# EAGLE schematic RF1 (EAGLE 6.4)
www.komby.com/RF1
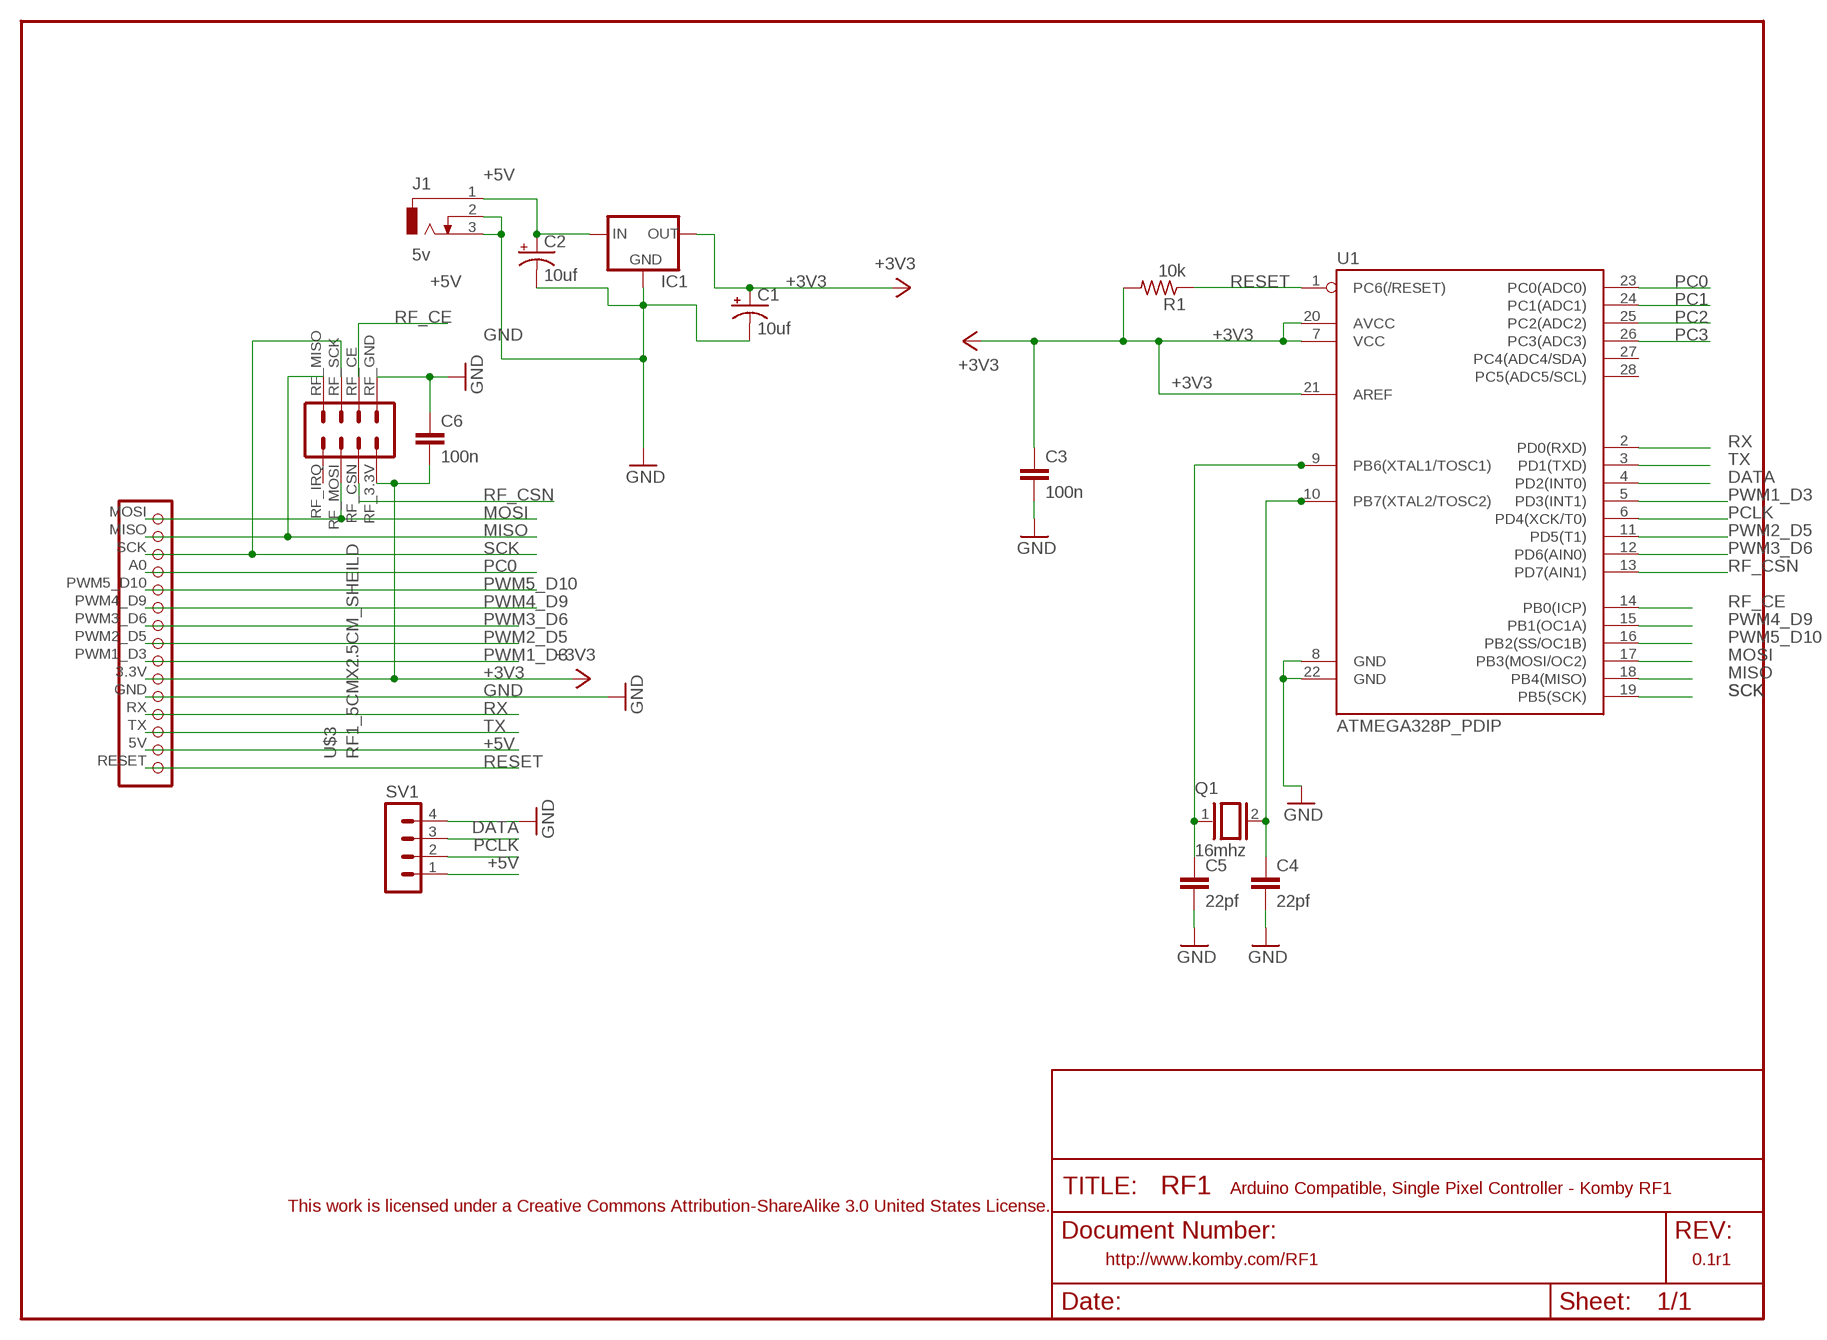
[diagram p0: schematic, sheet 1]

## Parts
C1  10uf  CPOL-USE1.8-4  [E1,8-4]
C2  10uf  CPOL-USE1.8-4  [E1,8-4]
C3  100n  C-EU025-024X044  [C025-024X044]
C4  22pf  C-EU025-024X044  [C025-024X044]
C5  22pf  C-EU025-024X044  [C025-024X044]
C6  100n  C-EU025-024X044  [C025-024X044]
IC1  MCP1700TRI  [TO92]
J1  5v  DCJ0303  [DCJ0303]
Q1  16mhz  XTAL/S  [QS]
R1  10k  R-US_0207/7  [0207/7]
SV1  MA04-1  [MA04-1]
U1  ATMEGA328P_PDIP  [DIL28-3]
U$3  RF1_5CMX2.5CM_SHEILD  [KOMBY_RF1_SHEILD_5X2.5]

## Nets
+3V3 [vcc]: C1.+ C3.1 C6.2 IC1.3(OUT) R1.2 U1.7(VCC) U1.20(AVCC) U1.21(AREF) U$3.3.3V U$3.RF_3.3V
+5V: C2.+ IC1.2(IN) J1.1 SV1.1 U$3.5V
DATA: SV1.3 U1.4(PD2(INT0))
GND [vcc]: C1.- C2.- C3.2 C4.2 C5.2 C6.1 IC1.1(GND) J1.2 J1.3 SV1.4 U1.8(GND) U1.22(GND) U$3.GND U$3.RF_GND(RFGND_1)
MISO: U1.18(PB4(MISO)) U$3.MISO U$3.RF_MISO
MOSI: U1.17(PB3(MOSI/OC2)) U$3.MOSI U$3.RF_MOSI
N$5: C4.1 Q1.2 U1.10(PB7(XTAL2/TOSC2))
N$6: C5.1 Q1.1 U1.9(PB6(XTAL1/TOSC1))
PC0: U1.23(PC0(ADC0)) U$3.A0(PC0)
PC1: U1.24(PC1(ADC1))
PC2: U1.25(PC2(ADC2))
PC3: U1.26(PC3(ADC3))
PCLK: SV1.2 U1.6(PD4(XCK/T0))
PWM1_D3: U1.5(PD3(INT1)) U$3.PWM1_D3(PWM1)
PWM2_D5: U1.11(PD5(T1)) U$3.PWM2_D5(PWM2)
PWM3_D6: U1.12(PD6(AIN0)) U$3.PWM3_D6(PWM3)
PWM4_D9: U1.15(PB1(OC1A)) U$3.PWM4_D9(PWM4)
PWM5_D10: U1.16(PB2(SS/OC1B)) U$3.PWM5_D10(PWM5)
RESET: R1.1 U1.1(PC6(/RESET)) U$3.RESET
RF_CE: U1.14(PB0(ICP)) U$3.RF_CE
RF_CSN: U1.13(PD7(AIN1)) U$3.RF_CSN
RX: U1.2(PD0(RXD)) U$3.RX
SCK: U1.19(PB5(SCK)) U$3.RF_SCK U$3.SCK
TX: U1.3(PD1(TXD)) U$3.TX
Unconnected: U1.27(PC4(ADC4/SDA)) U1.28(PC5(ADC5/SCL)) U$3.RF_IRQ

## Notes on the sheet
- Arduino Compatible, Single Pixel Controller - Komby RF1
- This work is licensed under a Creative Commons Attribution-ShareAlike 3.0 United States License.
- http://www.komby.com/RF1 | 0.1r1

## Library data of the parts
C1 C2 = adafruit:CPOL-US: POLARIZED CAPACITOR, American symbol
C3-C6 = resistor:C-EU: CAPACITOR, European symbol
IC1 = adafruit:MCP1700: VOLTAGE REGULATOR
J1 = con-jack:DCJ0303: DC POWER JACK Source: DCJ0303.pdf; OC_FARNELL: unknown; OC_NEWARK: unknown
Q1 = special:XTAL/S: CRYSTAL
R1 = adafruit:R-US_: RESISTOR, American symbol
SV1 = con-lstb:MA04-1: PIN HEADER; OC_FARNELL: unknown; OC_NEWARK: unknown
U1 = SparkFun-DigitalIC:ATMEGA328P_PDIP: uC used in the Arduino 32kb flash, 1k EEPROM, 2k SRAM This is the through-hole version of this chip.
U$3 = komby1:RF1_5CMX2.5CM_SHEILD

## Net classes
0 default: width 0.203 mm
1 vcc: width 0.305 mm
2 gnd: width 0.254 mm